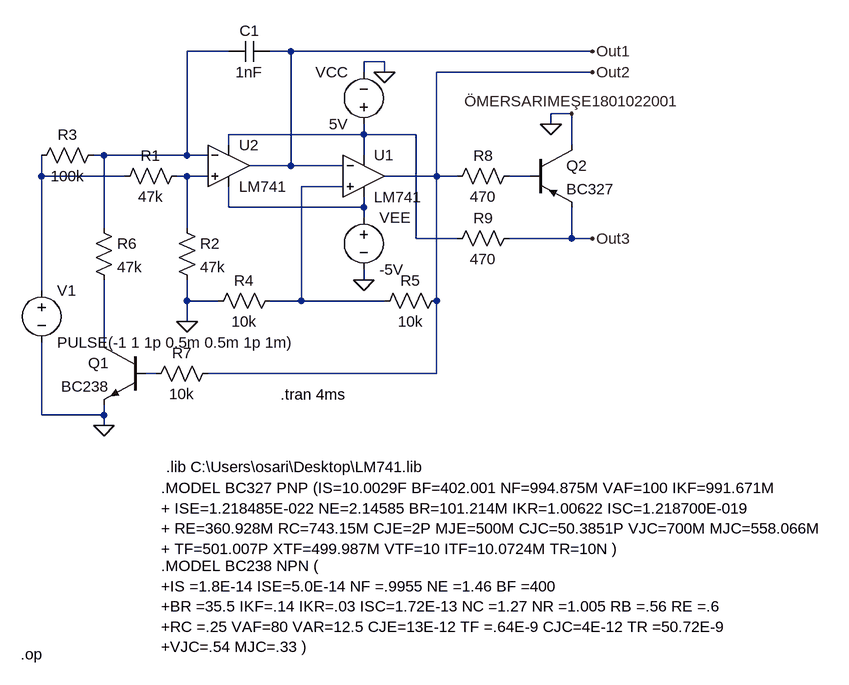
[diagram p0: schematic VCO.asc]
VCO.asc, the LTspice schematic file:
Version 4
SHEET 1 944 880
WIRE -32 -64 -96 -64
WIRE 64 -64 32 -64
WIRE 528 -64 64 -64
WIRE 208 -48 176 -48
WIRE 176 -32 176 -48
WIRE 208 -32 208 -48
WIRE 528 -32 288 -32
WIRE 496 32 464 32
WIRE 464 48 464 32
WIRE 176 64 176 48
WIRE 176 64 -32 64
WIRE 256 64 176 64
WIRE -32 80 -32 64
WIRE 496 80 496 32
WIRE -224 96 -240 96
WIRE -96 96 -96 -64
WIRE -96 96 -224 96
WIRE -64 96 -96 96
WIRE 176 96 176 64
WIRE 64 112 64 -64
WIRE 64 112 0 112
WIRE 144 112 64 112
WIRE -320 128 -320 96
WIRE -192 128 -320 128
WIRE -96 128 -112 128
WIRE -64 128 -96 128
WIRE 288 128 288 -32
WIRE 288 128 208 128
WIRE 320 128 288 128
WIRE 432 128 400 128
WIRE 144 144 80 144
WIRE -32 176 -32 144
WIRE 176 176 176 160
WIRE 176 176 -32 176
WIRE 176 192 176 176
WIRE -224 208 -224 96
WIRE -96 208 -96 128
WIRE 256 224 256 64
WIRE 320 224 256 224
WIRE 496 224 496 176
WIRE 496 224 400 224
WIRE 528 224 496 224
WIRE 176 288 176 272
WIRE -320 304 -320 128
WIRE -96 320 -96 288
WIRE -48 320 -96 320
WIRE 80 320 80 144
WIRE 80 320 32 320
WIRE 208 320 80 320
WIRE 288 320 288 128
WIRE -96 352 -96 320
WIRE -224 384 -224 288
WIRE -144 432 -160 432
WIRE 288 432 288 320
WIRE 288 432 -64 432
WIRE -320 496 -320 384
WIRE -224 496 -224 480
WIRE -224 496 -320 496
WIRE -224 512 -224 496
FLAG 208 -32 0
FLAG 176 288 0
FLAG -96 352 0
FLAG 464 48 0
FLAG -224 512 0
FLAG 528 -64 Out1
FLAG 528 -32 Out2
FLAG 528 224 Out3
FLAG 496 32 ÖMERSARIMEŞE1801022001
SYMBOL OpAmps\\opamp2 176 64 R0
SYMATTR InstName U1
SYMATTR Value LM741
SYMBOL OpAmps\\opamp2 -32 48 R0
SYMATTR InstName U2
SYMATTR Value LM741
SYMBOL voltage 176 176 R0
WINDOW 123 0 0 Left 0
WINDOW 39 0 0 Left 0
SYMATTR InstName VEE
SYMATTR Value -5V
SYMBOL voltage 176 64 R180
WINDOW 0 24 96 Left 2
WINDOW 3 24 16 Left 2
WINDOW 123 0 0 Left 0
WINDOW 39 0 0 Left 0
SYMATTR InstName VCC
SYMATTR Value 5V
SYMBOL cap 32 -80 R90
WINDOW 0 0 32 VBottom 2
WINDOW 3 32 32 VTop 2
SYMATTR InstName C1
SYMATTR Value 1nF
SYMBOL res -96 112 R90
WINDOW 0 0 56 VBottom 2
WINDOW 3 32 56 VTop 2
SYMATTR InstName R1
SYMATTR Value 47k
SYMBOL res -112 192 R0
SYMATTR InstName R2
SYMATTR Value 47k
SYMBOL res -224 80 R90
WINDOW 0 0 56 VBottom 2
WINDOW 3 32 56 VTop 2
SYMATTR InstName R3
SYMATTR Value 100k
SYMBOL res 48 304 R90
WINDOW 0 0 56 VBottom 2
WINDOW 3 32 56 VTop 2
SYMATTR InstName R4
SYMATTR Value 10k
SYMBOL res 304 304 R90
WINDOW 0 0 56 VBottom 2
WINDOW 3 32 56 VTop 2
SYMATTR InstName R5
SYMATTR Value 10k
SYMBOL res -240 192 R0
SYMATTR InstName R6
SYMATTR Value 47k
SYMBOL res -160 448 R270
WINDOW 0 32 56 VTop 2
WINDOW 3 0 56 VBottom 2
SYMATTR InstName R7
SYMATTR Value 10k
SYMBOL npn -160 384 M0
SYMATTR InstName Q1
SYMATTR Value BC238
SYMBOL res 416 112 R90
WINDOW 0 0 56 VBottom 2
WINDOW 3 32 56 VTop 2
SYMATTR InstName R8
SYMATTR Value 470
SYMBOL res 416 208 R90
WINDOW 0 0 56 VBottom 2
WINDOW 3 32 56 VTop 2
SYMATTR InstName R9
SYMATTR Value 470
SYMBOL pnp 432 80 R0
SYMATTR InstName Q2
SYMATTR Value BC327
SYMBOL voltage -320 288 R0
WINDOW 123 0 0 Left 0
WINDOW 39 0 0 Left 0
SYMATTR InstName V1
SYMATTR Value PULSE(-1 1 1p 0.5m 0.5m 1p 1m)
TEXT -136 728 Left 2 !.MODEL BC238 NPN (\n+IS =1.8E-14 ISE=5.0E-14 NF =.9955 NE =1.46 BF =400\n+BR =35.5 IKF=.14 IKR=.03 ISC=1.72E-13 NC =1.27 NR =1.005 RB =.56 RE =.6\n+RC =.25 VAF=80 VAR=12.5 CJE=13E-12 TF =.64E-9 CJC=4E-12 TR =50.72E-9\n+VJC=.54 MJC=.33 )
TEXT -136 608 Left 2 !.MODEL BC327 PNP (IS=10.0029F BF=402.001 NF=994.875M VAF=100 IKF=991.671M\n+ ISE=1.218485E-022 NE=2.14585 BR=101.214M IKR=1.00622 ISC=1.218700E-019\n+ RE=360.928M RC=743.15M CJE=2P MJE=500M CJC=50.3851P VJC=700M MJC=558.066M\n+ TF=501.007P XTF=499.987M VTF=10 ITF=10.0724M TR=10N )
TEXT -128 576 Left 2 !.lib C:\\Users\\osari\\Desktop\\LM741.lib
TEXT -352 864 Left 2 !.op
TEXT 48 464 Left 2 !.tran 4ms

The netlist it stands for:
* VCO.asc
XU1 N006 Out1 N002 N007 Out2 LM741  ; pins In+ In- V+ V- OUT
XU2 N004 N001 N002 N007 Out1 LM741  ; pins In+ In- V+ V- OUT
VEE N007 0 -5V
VCC N002 0 5V
C1 Out1 N001 1nF
R1 N004 N003 47k
R2 N004 0 47k
R3 N001 N003 100k
R4 N006 0 10k
R5 Out2 N006 10k
R6 N001 N008 47k
R7 N009 Out2 10k
Q1 N008 N009 0 0 BC238
R8 N005 Out2 470
R9 Out3 N002 470
Q2 0 N005 Out3 0 BC327
V1 N003 0 PULSE(-1 1 1p 0.5m 0.5m 1p 1m)
.model NPN NPN
.model PNP PNP
.lib standard.bjt
.MODEL BC238 NPN (
+IS =1.8E-14 ISE=5.0E-14 NF =.9955 NE =1.46 BF =400
+BR =35.5 IKF=.14 IKR=.03 ISC=1.72E-13 NC =1.27 NR =1.005 RB =.56 RE =.6
+RC =.25 VAF=80 VAR=12.5 CJE=13E-12 TF =.64E-9 CJC=4E-12 TR =50.72E-9
+VJC=.54 MJC=.33 )
.MODEL BC327 PNP (IS=10.0029F BF=402.001 NF=994.875M VAF=100 IKF=991.671M
+ ISE=1.218485E-022 NE=2.14585 BR=101.214M IKR=1.00622 ISC=1.218700E-019
+ RE=360.928M RC=743.15M CJE=2P MJE=500M CJC=50.3851P VJC=700M MJC=558.066M
+ TF=501.007P XTF=499.987M VTF=10 ITF=10.0724M TR=10N )
.lib C:\Users\osari\Desktop\LM741.lib
.op
.tran 4ms
.backanno
.end